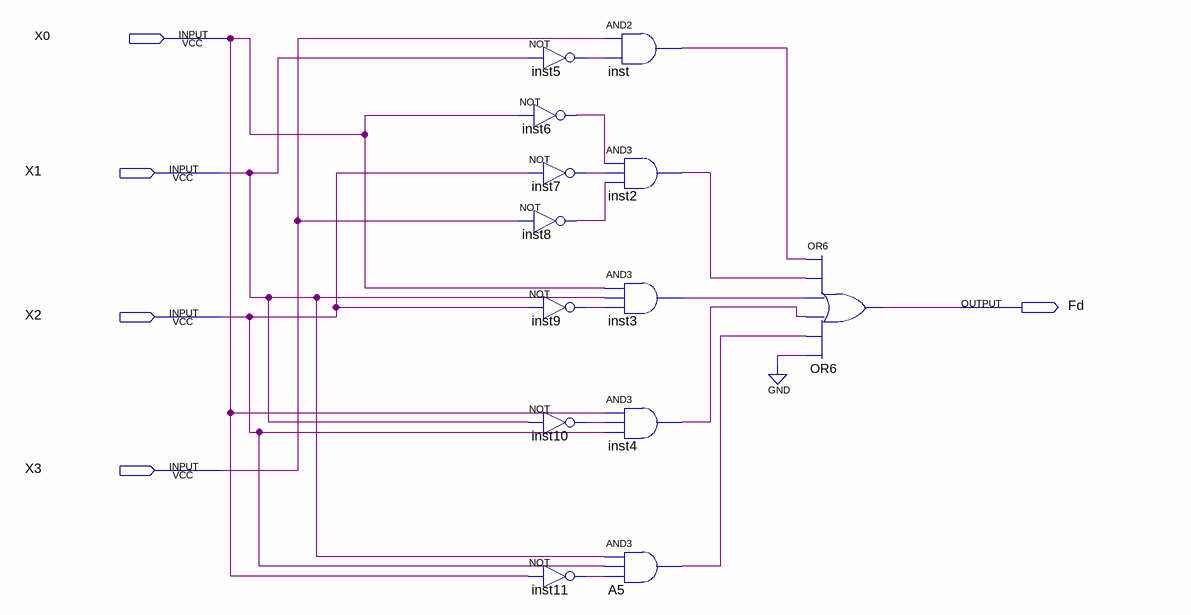
[diagram p0: schematic sheet]
// Quartus schematic Segmento4.bdf as structural Verilog: 13 symbols, 5 pins
module Segmento4 (
  input  X0,
  input  X1,
  input  X2,
  input  X3,
  output Fd
);

  wire A5_out, inst2_out, inst3_out, inst4_out, inst5_out, inst6_out, inst7_out, inst8_out, inst9_out,
       inst10_out, inst11_out, inst_out;

  not inst5 (inst5_out, X1);
  not inst6 (inst6_out, X0);
  not inst7 (inst7_out, X2);
  not inst8 (inst8_out, X3);
  not inst9 (inst9_out, X2);
  not inst10 (inst10_out, X1);
  not inst11 (inst11_out, X0);
  and inst (inst_out, X3, inst5_out);
  and inst2 (inst2_out, inst6_out, inst7_out, inst8_out);
  and inst3 (inst3_out, X0, X1, inst9_out);
  and inst4 (inst4_out, X0, inst10_out, X2);
  and A5 (A5_out, X1, X2, inst11_out);
  or OR6 (Fd, inst_out, inst2_out, inst3_out, inst4_out, A5_out, 1'b0);
endmodule
